# Altium schematic sheet carsystem.SchDoc
size A4
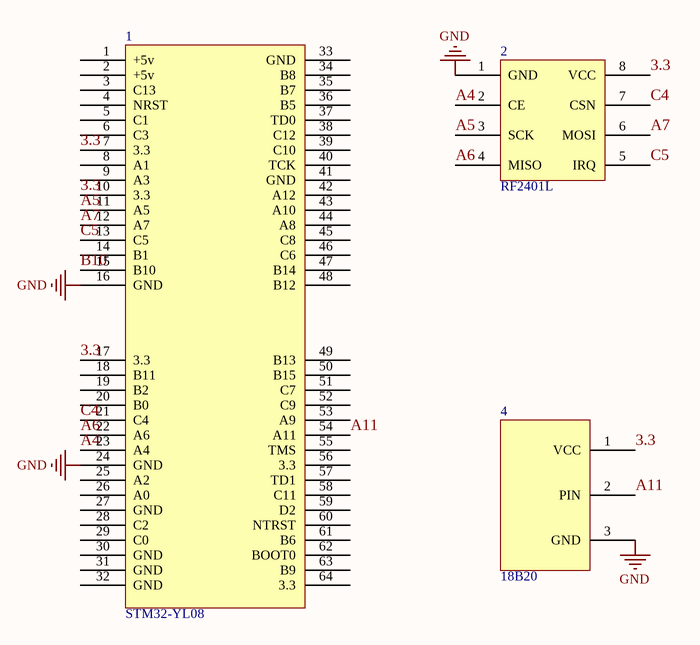
[diagram p0: carsystem.SchDoc]

## Parts
1  STM32-YL08  [STM32-YL08]
2  RF2401L  [RF2401L]
4  18B20  [18B20]

## Nets
GND: 1.16(GND) 1.24(GND) 2.1(GND) 4.3(GND)
3.3: 1.7(3.3) 1.10(3.3) 1.17(3.3) 2.8(VCC) 4.1(VCC)
A4: 1.23(A4) 2.2(CE)
A5: 1.11(A5) 2.3(SCK)
A6: 1.22(A6) 2.4(MISO)
A7: 1.12(A7) 2.6(MOSI)
A11: 1.54(A11) 4.2(PIN)
B10: 1.15(B10)
C4: 1.21(C4) 2.7(CSN)
C5: 1.13(C5) 2.5(IRQ)

Not connected (* = marked no-connect by the designer): 1 1(+5v) 2(+5v) 3(C13) 4(NRST) 5(C1) 6(C3) 8(A1) 9(A3) 14(B1) 18(B11) 19(B2) 20(B0) 25(A2) 26(A0) 27(GND) 28(C2) 29(C0) 30(GND) 31(GND) 32(GND) 33(GND) 34(B8) 35(B7) 36(B5) 37(TD0) 38(C12) 39(C10) 40(TCK) 41(GND) 42(A12) 43(A10) 44(A8) 45(C8) 46(C6) 47(B14) 48(B12) 49(B13) 50(B15) 51(C7) 52(C9) 53(A9) 55(TMS) 56(3.3) 57(TD1) 58(C11) 59(D2) 60(NTRST) 61(B6) 62(BOOT0) 63(B9) 64(3.3)